# Altium schematic sheet 1.SchDoc
size OrCAD E
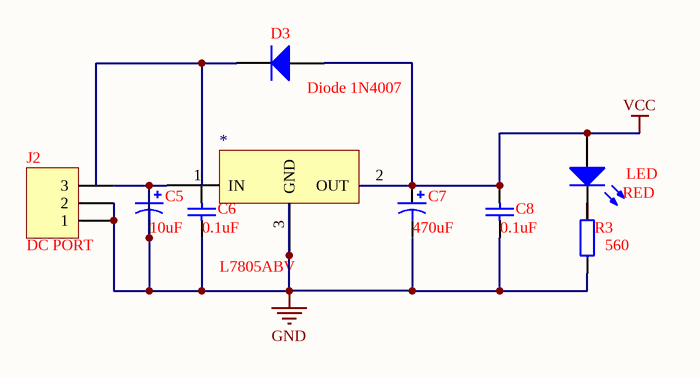
[diagram p0: 1.SchDoc]

## Parts
*  L7805ABV
C5  value 10uF  [RB7.6-15]  (hidden comment: Cap Pol1)
C6  value 0.1uF  [0402]  (hidden comment: Cap Semi)
C7  value 470uF  [1812]  (hidden comment: Cap Pol3)
C8  value 0.1uF  [0402]  (hidden comment: Cap Semi)
D3  Diode 1N4007  [SMC]
J2  DC PORT  [HDR1X3]
LED  RED  [LED-0]
R3  value 560  [AXIAL-0.4]  (hidden comment: Res2)

## Nets
GND: *.1(IN) *.3(GND) C5.1 C5.2 C6.1 C7.2 C8.1 J2.1 J2.2 J2.3 R3.2
VCC: *.2(OUT) C7.1 C8.2 D3.1(A) LED.1(A)
NetC6_2: C6.2 D3.2(K)

Not connected (* = marked no-connect by the designer): LED 2(K); R3 1

## Library data of the parts
C5 = Cap Pol1: Polarized Capacitor (Radial); Published: 8-Jun-2000; LatestRevisionDate: 17-Jul-2002; LatestRevisionNote: Re-released for DXP Platform.; PackageReference: RB7.6-15; Publisher: Altium Limited; PackageDescription: Polarized Capacitor (Radial); 2 Leads
C6 C8 = Cap Semi: Capacitor (Semiconductor SIM Model); Published: 8-Jun-2000; LatestRevisionDate: 29-May-2009; LatestRevisionNote: IPC-7351 Footprint Added.; PackageReference: C1206; Publisher: Altium Limited; PackageDescription: Chip Capacitor
C7 = Cap Pol3: Polarized Capacitor (Surface Mount); Published: 8-Jun-2000; LatestRevisionDate: 29-May-2009; LatestRevisionNote: IPC-7351 Footprint Added.; PackageReference: C0805; Publisher: Altium Limited; PackageDescription: Chip Capacitor
D3 = Diode: Default Diode; Published: 8-Jun-2000; LatestRevisionDate: 17-Jul-2002; LatestRevisionNote: Re-released for DXP Platform.; PackageVersion: Sep-1996; PackageReference: SMC; Publisher: Altium Limited; PackageDescription: DO-214-AB/SMC; 2 C-Bend Leads; Body 7.9 x 5.9 mm, inc. leads (LxW); Code_JEDEC: DO-214-AB
J2 = Header 3: Header, 3-Pin; LatestRevisionDate: 17-Jul-2002; LatestRevisionNote: Re-released for DXP Platform.; Publisher: Altium Limited
LED = LED0: Typical INFRARED GaAs LED; Published: 8-Jun-2000; LatestRevisionDate: 08-Jul-2005; LatestRevisionNote: Mech Layer 1 removed.; PackageReference: LED-0; Publisher: Altium Limited; PackageDescription: LED; 2 Leads
R3 = Res2: Resistor; Published: 8-Jun-2000; LatestRevisionDate: 17-Jul-2002; LatestRevisionNote: Re-released for DXP Platform.; PackageReference: AXIAL-0.4; Publisher: Altium Limited; PackageDescription: Axial Device, Thru-Hole; 2 Leads; 0.4 in Pin Spacing